# EAGLE design awc_v1 (EAGLE 8.4.2)
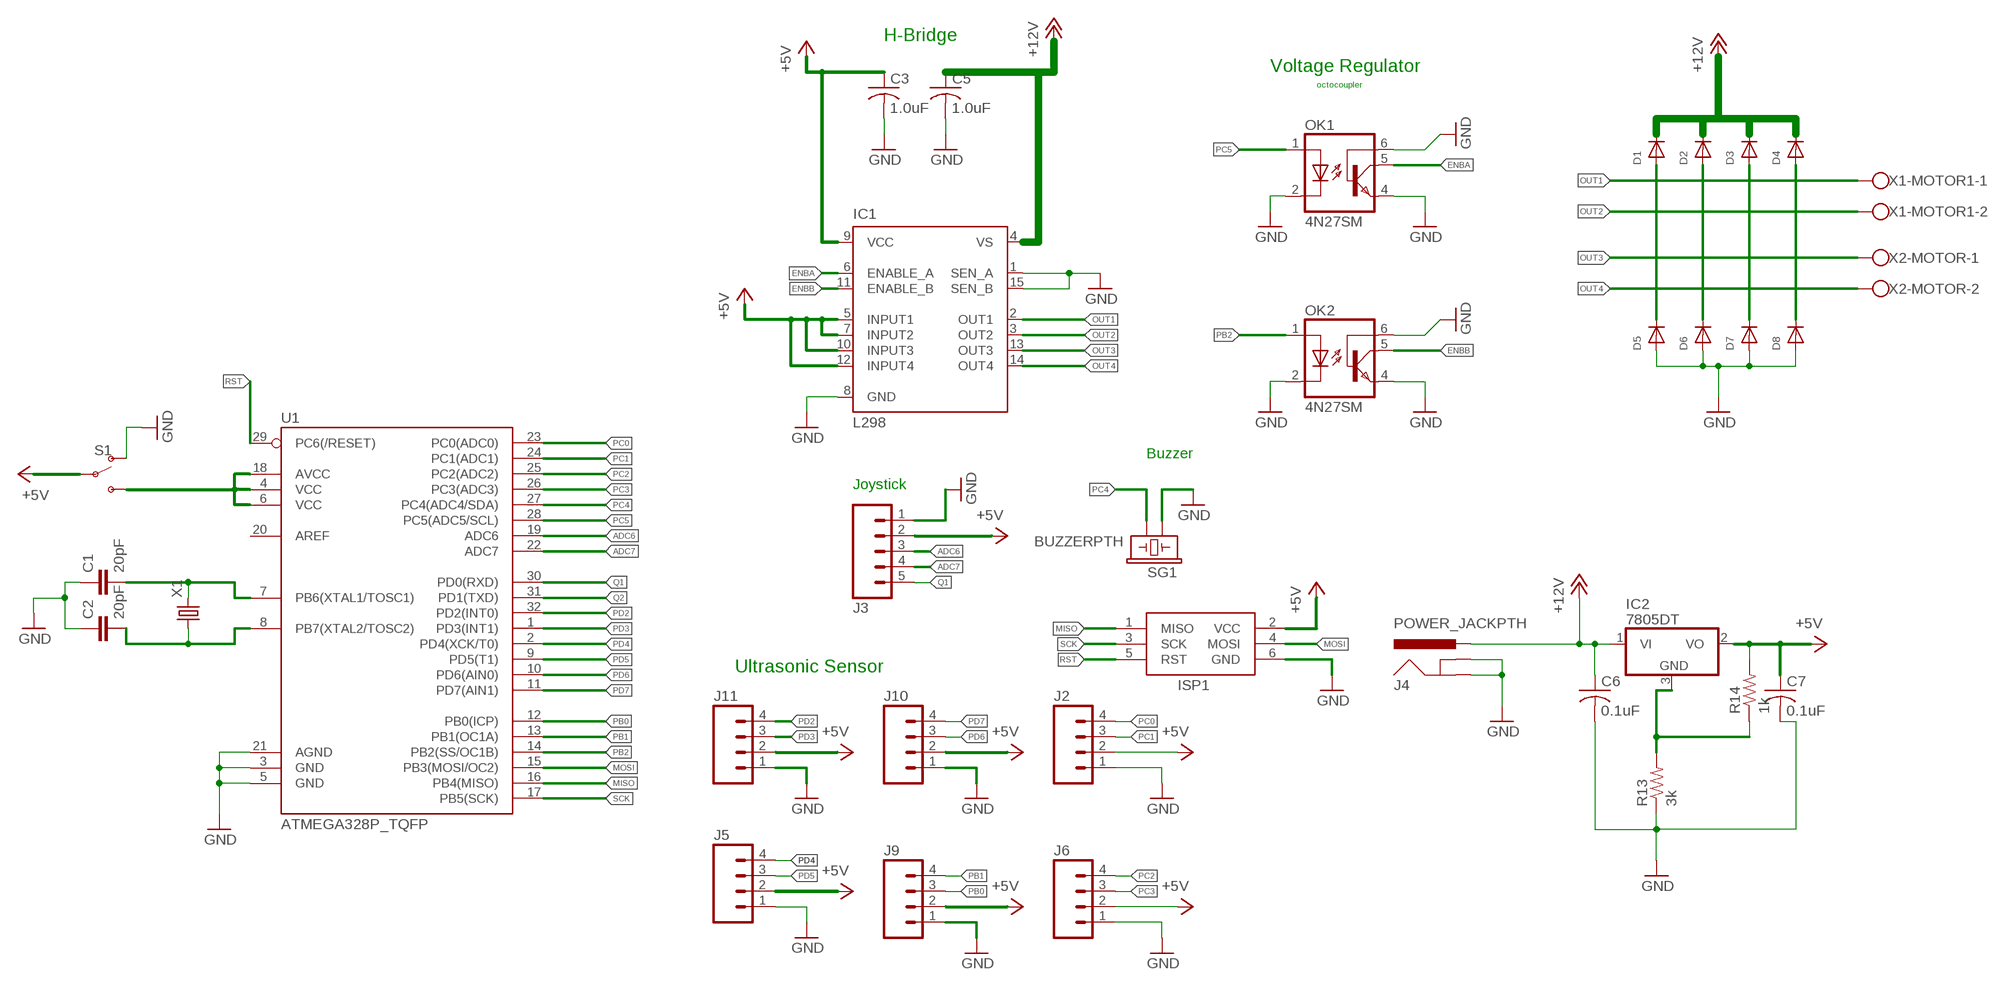
[diagram p0: schematic, sheet 1]

## Parts
C1  20pF  C-EUC0805  [C0805]
C2  20pF  C-EUC0805  [C0805]
C3  1.0uF  C-USC0805  [C0805]
C5  1.0uF  C-USC0805  [C0805]
C6  0.1uF  C-USC0805  [C0805]
C7  0.1uF  C-USC0805  [C0805]
D1  DIODESOD-523  [SOD-523]
D2  DIODESOD-523  [SOD-523]
D3  DIODESOD-523  [SOD-523]
D4  DIODESOD-523  [SOD-523]
D5  DIODESOD-523  [SOD-523]
D6  DIODESOD-523  [SOD-523]
D7  DIODESOD-523  [SOD-523]
D8  DIODESOD-523  [SOD-523]
IC1  L298  [MULTIWATT-15]
IC2  7805DT  [TO252]
ISP1  AVRISP-6  [AVRISP]
J2  M04SCREW_LOCK  [SCREWTERMINAL-3.5MM-4_LOCK]
J3  M05SCREW  [SCREWTERMINAL-3.5MM-5]
J4  POWER_JACKPTH  [POWER_JACK_PTH]
J5  M04SCREW_LOCK  [SCREWTERMINAL-3.5MM-4_LOCK]
J6  M04SCREW_LOCK  [SCREWTERMINAL-3.5MM-4_LOCK]
J9  M04SCREW_LOCK  [SCREWTERMINAL-3.5MM-4_LOCK]
J10  M04SCREW_LOCK  [SCREWTERMINAL-3.5MM-4_LOCK]
J11  M04SCREW_LOCK  [SCREWTERMINAL-3.5MM-4_LOCK]
OK1  4N27SM  [DIL6-SMD]
OK2  4N27SM  [DIL6-SMD]
R13  3k  RESISTOR0402  [0402-RES]
R14  1k  R-US_M0805  [M0805]
S1  SWITCH-SPDT-PTH-11.6X4.0MM  [SWITCH_SPDT_PTH_11.6X4.0MM]
SG1  BUZZERPTH  [BUZZER-12MM]
U1  ATMEGA328P_TQFP  [TQFP32-08]
X1  CRYSTALHC49UP  [HC49UP]
X1-MOTOR1  W237-102  [W237-102]
X2-MOTOR  W237-102  [W237-102]

## Nets
+5V: C3.1 C7.1 IC1.5(INPUT1) IC1.7(INPUT2) IC1.9(VCC) IC1.10(INPUT3) IC1.12(INPUT4) IC2.2(VO) ISP1.2(VCC) J2.2 J3.2 J5.2 J6.2 J9.2 J10.2 J11.2 R14.2 S1.2(P)
+12V: C5.1 C6.1 D1.K(C) D2.K(C) D3.K(C) D4.K(C) IC1.4(VS) IC2.1(VI) J4.PWR
ADC6: J3.3 U1.19(ADC6)
ADC7: J3.4 U1.22(ADC7)
ENBA: IC1.6(ENABLE_A) OK1.5(COL)
ENBB: IC1.11(ENABLE_B) OK2.5(COL)
GND: C1.1 C2.1 C3.2 C5.2 C6.2 C7.2 D5.A D6.A D7.A D8.A IC1.1(SEN_A) IC1.8(GND) IC1.15(SEN_B) ISP1.6(GND) J2.1 J3.1 J4.GND J4.GNDBREAK J5.1 J6.1 J9.1 J10.1 J11.1 OK1.2(C) OK1.4(EMI) OK1.6(BAS) OK2.2(C) OK2.4(EMI) OK2.6(BAS) R13.1 S1.1(O) SG1.+ U1.3(GND) U1.5(GND) U1.21(AGND)
MISO: ISP1.1(MISO) U1.16(PB4(MISO))
MOSI: ISP1.4(MOSI) U1.15(PB3(MOSI/OC2))
N$1: D1.A D5.K(C)
N$2: D2.A D6.K(C)
N$3: D3.A D7.K(C)
N$4: D4.A D8.K(C)
N$5: C1.2 U1.7(PB6(XTAL1/TOSC1)) X1.2
N$6: C2.2 U1.8(PB7(XTAL2/TOSC2)) X1.1
N$7: IC2.3(GND) R13.2 R14.1
N$8: S1.3(S) U1.4(VCC) U1.6(VCC) U1.18(AVCC)
OUT1: IC1.2(OUT1) X1-MOTOR1.1
OUT2: IC1.3(OUT2) X1-MOTOR1.2
OUT3: IC1.13(OUT3) X2-MOTOR.1
OUT4: IC1.14(OUT4) X2-MOTOR.2
PB0: J9.3 U1.12(PB0(ICP))
PB1: J9.4 U1.13(PB1(OC1A))
PB2: OK2.1(A) U1.14(PB2(SS/OC1B))
PC0: J2.4 U1.23(PC0(ADC0))
PC1: J2.3 U1.24(PC1(ADC1))
PC2: J6.4 U1.25(PC2(ADC2))
PC3: J6.3 U1.26(PC3(ADC3))
PC4: SG1.- U1.27(PC4(ADC4/SDA))
PC5: OK1.1(A) U1.28(PC5(ADC5/SCL))
PD2: J11.4 U1.32(PD2(INT0))
PD3: J11.3 U1.1(PD3(INT1))
PD4: J5.4 U1.2(PD4(XCK/T0))
PD5: J5.3 U1.9(PD5(T1))
PD6: J10.3 U1.10(PD6(AIN0))
PD7: J10.4 U1.11(PD7(AIN1))
Q1: J3.5 U1.30(PD0(RXD))
Q2: U1.31(PD1(TXD))
RST: ISP1.5(RST) U1.29(PC6(/RESET))
SCK: ISP1.3(SCK) U1.17(PB5(SCK))
Unconnected: U1.20(AREF)

## Notes on the sheet
- H-Bridge
- Voltage Regulator
- octocoupler
- Buzzer
- Joystick
- Ultrasonic Sensor

## Library data of the parts
C1 C2 = resistor:C-EU: CAPACITOR, European symbol
C3 C5-C7 = adafruit:C-US: CAPACITOR, American symbol
D1-D8 = adafruit:DIODE: Diode SMADIODE - SMA Surface Mount Package 20V 1A Schottky Diode Digikey: 641-1014-6-ND DO-1N4148 - Through Hole Small Current Diode SOD-123 20V 1 A (.5mV Vf) Schottky Diode - Digikey: MBRX120TPMSCT-ND SOD-323 10V 570mA (.38mV Vf, 3ns) Schottky Diode - Digikey: ZLLS410CT-ND SOD-523 30V 30mA Schottky Diode (RB751S-40TE61) - Digikey: RB751S-40TE61CT-ND SOT23-R/W - SOT23 Package (R = Solder Paste/Reflow Ovens, W = Hand-Soldering) BAT54Film 40V 300mA - Digikey: 497-7162-1-ND
IC1 = st-microelectronics:L298: DUAL FULL-BRIDGE DRIVER; MPN: L298N; OC_FARNELL: 1589425; OC_NEWARK: 32M1527
IC2 = ece388:78*: Positive VOLTAGE REGULATOR Added bigger pads to the TO-92 package
ISP1 = adafruit:AVRISP: AVR ISP HEADER Standard 6 pin header for AVR programming
J2 J5 J6 J9-J11 = SparkFun-Connectors:M04: Header 4 Standard 4-pin 0.1" header. Use with straight break away headers (SKU : PRT-00116), right angle break away headers (PRT-00553), swiss pins (PRT-00743), machine pins (PRT-00117), and female headers (PRT-00115). Molex polarized connector foot print use with SKU : PRT-08231 with associated crimp pins and housings. 1MM SMD Version SKU: PRT-10208
J3 = SparkFun-Connectors:M05: Header 5 Standard 5-pin 0.1" header. Use with straight break away headers (SKU : PRT-00116), right angle break away headers (PRT-00553), swiss pins (PRT-00743), machine pins (PRT-00117), and female headers (PRT-00115). Molex polarized connector foot print use with SKU : PRT-08230 with associated crimp pins and housings.; PROD_ID: Combine 8288+8399
J4 = SparkFun-Connectors:POWER_JACK: Power Jack This is the standard 5.5mm barrel jack for power. The PTH is the most common, proven, reliable, footprint. The Slot footprint only works if the mill layer is transmitted to the PCB fab house so be warned. Mating wall wart : TOL-00298 (and others); PROD_ID: CONN-08197
OK1 OK2 = optocoupler:4N*?M: General Purpose 6-Pin Phototransistor Optocouplers Source: http://www.fairchildsemi.com/ds/4N/4N35-M.pdf; MF: FAIRCHILD SEMICONDUCTOR; MPN: 4N27S-M; OC_FARNELL: unknown; OC_NEWARK: 05C3300
R13 = SparkFun-Resistors:RESISTOR: Resistor Basic schematic elements and footprints for 0603, 1206, and PTH resistors.
R14 = adafruit:R-US_: RESISTOR, American symbol
S1 = SparkFun-Switches:SWITCH-SPDT: Single Pole, Double Throw (SPDT) Switch Single-pole, double-throw (SPDT) switch. Variant Overview SMD-AYZ0202 Surface Mount DPDT Switch <https://www.sparkfun.com/products/597> (COM-00597) Used on e.g. LilyPad Arduino USB - ATmega32U4 Board <https://www.sparkfun.com/products/12049> PTH-11.6X4.0MM SPDT Mini Power Switch <https://www.sparkfun.com/products/102> (COM-00102) Used on e.g. SparkFun Simon Says - Through-Hole Soldering Kit <https://www.sparkfun.com/products/10547> (KIT-10547) PTH-11.6X4.0MM-KIT KIT version of SPDT Mini Power Switch - Simplifies soldering by removing tStop of switch pins - only one side can be soldered. PTH-11.6X4.0MM-LOCK LOCK version of SPDT Mini Power Switch - Offset pins hold switch in place for easier soldering. SMD-RIGHT-ANGLE Surface Mount Right Angle Switch <https://www.sparkfun.com/products/10860> (COM-10860) Used on e.g. SparkFun ESP8266 Thing <https://www.sparkfun.com/products/13231>; PROD_ID: SWCH-08261; SF_SKU: COM-00102
SG1 = SparkFun-Electromechanical:BUZZER: Buzzer 12mm Spark Fun Electronics SKU : Comp-Buzzer
U1 = SparkFun-DigitalIC:ATMEGA328P_TQFP; PROD_ID: IC-09069
X1 = adafruit:CRYSTAL: CRYSTAL; OC_FARNELL: unknown; OC_NEWARK: unknown
X1-MOTOR1 X2-MOTOR = con-wago-500:W237-102: WAGO SCREW CLAMP; MPN: 237-102; OC_FARNELL: unknown; OC_NEWARK: 70K9898

## Board
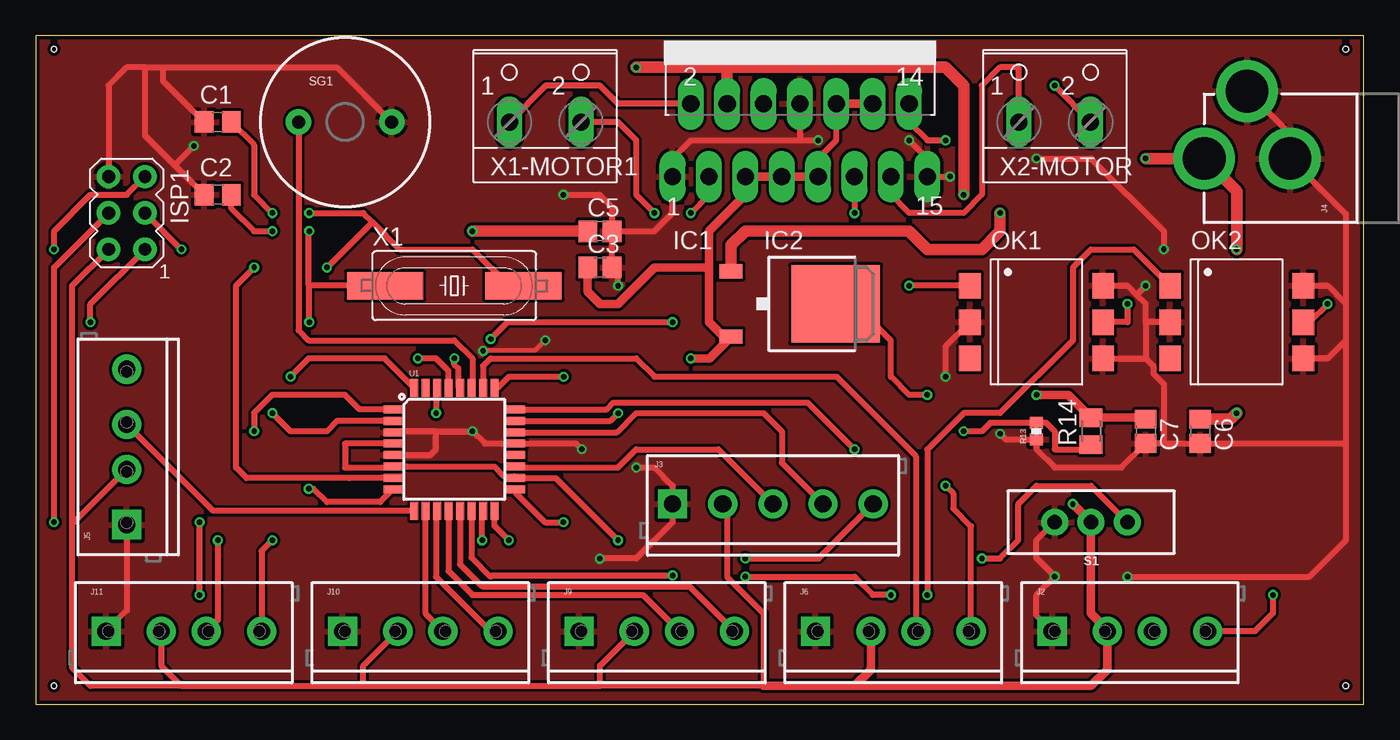
[diagram p1: board, top side]
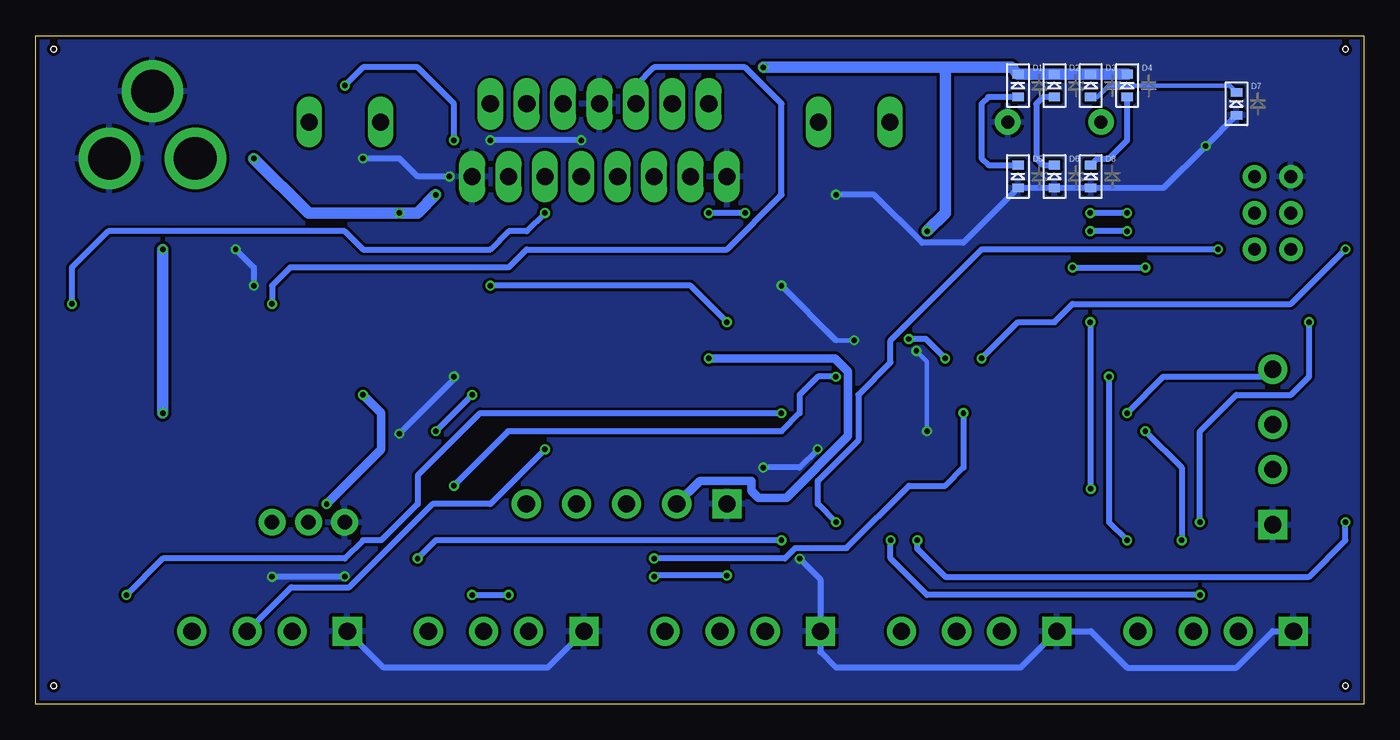
[diagram p2: board, bottom side, seen from below]

Size 92.69 x 46.66 mm. Coordinates in mm from the lower left corner, seen from the top.
Outline: 0,0 92.69,0 92.69,46.66 0,46.66 0,0
Copper layers (1*16): Top 0.035mm / dielectric 1.5mm / Bottom 0.035mm
Design rules "Dirty8TS": minimum track width 8mil, minimum drill 15mil, track to track 8mil, track to pad 8mil, pad to pad 8mil, via to via 8mil, smd to smd 0mil, copper to edge 10mil, drill to drill 10mil, minimum pad ring 10mil, minimum via ring 6mil, stop-mask expansion 2mil, vias tented up to drill 25mil, thermal gap 10mil
Holes 0.38 mm at 1.27,45.72 1.27,1.27 91.44,1.27 91.44,45.72

### Footprints (pad centres in the part's own frame; a part is rotated, then mirrored left to right if it is on the bottom)
C0805 = smd 1.3 x 1.5: 1 -0.95,0; 2 0.95,0
C0805' = smd 1.3 x 1.5: 1 -0.85,0; 2 0.85,0
SOD-523 = smd 0.8 x 0.6: A 0,-0.8; K 0,0.8
MULTIWATT-15 = drill 1.2 long: 1 -8.89,-7.62; 2 -7.62,-2.54; 3 -6.35,-7.62; 4 -5.08,-2.54; 5 -3.81,-7.62; 6 -2.54,-2.54; 7 -1.27,-7.62; 8 0,-2.54; 9 1.27,-7.62; 10 2.54,-2.54; 11 3.81,-7.62; 12 5.08,-2.54; 13 6.35,-7.62; 14 7.62,-2.54; 15 8.89,-7.62
TO252 = smd 1 x 1.6: 1 -2.28,-4.8; 2 2.28,-4.8 | smd 5.4 x 6.2: 3 0,2.5
AVRISP = drill 0.9 pad 1.626: 1 -1.27,2.54; 2 1.27,2.54; 3 -1.27,0; 4 1.27,0; 5 -1.27,-2.54; 6 1.27,-2.54
SCREWTERMINAL-3.5MM-4_LOCK = drill 1.2 pad 2.032 square: 1 -0.178,0 | drill 1.2 pad 2.032: 2 3.678,0; 3 6.822,0; 4 10.678,0
SCREWTERMINAL-3.5MM-5 = drill 1.2 pad 2.032 square: 1 0,0 | drill 1.2 pad 2.032: 2 3.5,0; 3 7,0; 4 10.5,0; 5 14,0
POWER_JACK_PTH = drill 2.997 pad 4.318: GND 0,7.7; GNDBREAK 4.7,10.7; PWR 0,13.7
DIL6-SMD = smd 1.78 x 1.52: 1 -2.54,-4.645; 2 0,-4.645; 3 2.54,-4.645; 4 2.54,4.645; 5 0,4.645; 6 -2.54,4.645
0402-RES = smd 0.85 x 0.9: 1 -0.58,0; 2 0.58,0
M0805 = smd 1.3 x 1.6: 1 -0.95,0; 2 0.95,0
SWITCH_SPDT_PTH_11.6X4.0MM = drill 1.016 pad 1.88: 1 0,2.54; 2 0,0; 3 0,-2.54
BUZZER-12MM = drill 0.9 pad 1.778: + 3.25,0; - -3.25,0
TQFP32-08 = smd 1.27 x 0.559: 1 -4.293,2.8; 2 -4.293,2; 3 -4.293,1.2; 4 -4.293,0.4; 5 -4.293,-0.4; 6 -4.293,-1.2; 7 -4.293,-2; 8 -4.293,-2.8; 17 4.293,-2.8; 18 4.293,-2; 19 4.293,-1.2; 20 4.293,-0.4; 21 4.293,0.4; 22 4.293,1.2; 23 4.293,2; 24 4.293,2.8 | smd 0.559 x 1.27: 9 -2.8,-4.293; 10 -2,-4.293; 11 -1.2,-4.293; 12 -0.4,-4.293; 13 0.4,-4.293; 14 1.2,-4.293; 15 2,-4.293; 16 2.8,-4.293; 25 2.8,4.293; 26 2,4.293; 27 1.2,4.293; 28 0.4,4.293; 29 -0.4,4.293; 30 -1.2,4.293; 31 -2,4.293; 32 -2.8,4.293
HC49UP = smd 5.334 x 1.93: 1 -4.826,0; 2 4.826,0
W237-102 = drill 1.194 long: 1 -2.5,-1.27; 2 2.5,-1.27

### Placement (x,y rotation side)
C1  12.7,40.64 0 top
C2  12.7,35.56 0 top
C3  1.0uF  [C0805']  39.37,30.48 0 top
C5  1.0uF  [C0805']  39.37,33.02 0 top
C6  0.1uF  [C0805']  81.28,19.05 270 top
C7  0.1uF  [C0805']  77.47,19.05 270 top
D1  24.13,43.18 0 bottom
D2  21.59,43.18 0 bottom
D3  19.05,43.18 0 bottom
D4  16.51,43.18 0 bottom
D5  24.13,36.83 0 bottom
D6  21.59,36.83 0 bottom
D7  8.89,41.91 0 bottom
D8  19.05,36.83 0 bottom
IC1  53.34,44.45 0 top
IC2  53.34,27.94 270 top
ISP1  6.35,34.29 180 top
J2  71.12,5.08 0 top
J3  44.45,13.97 0 top
J4  95.25,38.1 90 top
J5  6.35,12.7 90 top
J6  54.61,5.08 0 top
J9  38.1,5.08 0 top
J10  21.59,5.08 0 top
J11  5.08,5.08 0 top
OK1  69.85,26.67 270 top
OK2  83.82,26.67 270 top
R13  69.85,19.05 90 top
R14  73.66,19.05 90 top
S1  73.66,12.7 90 top
SG1  21.59,40.64 0 top
U1  29.21,17.78 0 top
X1  29.21,29.21 0 top
X1-MOTOR1  35.56,41.91 0 top
X2-MOTOR  71.12,41.91 0 top

### Tracks (layer width: path | path; a pad name or v marks a point on that pad's centre or on a via)
+5V  (via drill 0.38)
  Top 0.406: J11.2 8.76,2.67 10.16,1.27 | 10.16,1.27 22.86,1.27 | 22.86,1.27 39.37,1.27 | 39.37,1.27 39.37,2.67 J9.2 | 39.37,1.27 50.8,1.27 50.8,6.35 48.26,8.89 48.26,13.66 J3.2 | 10.16,1.27 3.81,1.27 2.54,2.54 2.54,12.57 | J5.2 2.54,12.57 | 2.54,12.57 2.54,29.21 ISP1.2 | IC2.2 | IC1.9 54.61,38.1 55.88,39.37 IC1.10 | J10.2 22.86,2.67 22.86,1.27
  Top 0.61: IC1.9 IC1.7 IC1.5 49.53,35.56 46.99,33.02 46.99,30.48 | IC1.10 IC1.12 | C7.1 77.37,20 R14.2 72.23,21.43 | C3.1 38.52,28.79 39.37,27.94 40.64,27.94 43.18,30.48 46.99,30.48 | 72.23,21.43 72.07,21.59 | J6.2 58.29,2.41 57.15,1.27 | 57.15,1.27 50.8,1.27 | 57.15,1.27 73.66,1.27 74.8,2.41 J2.2 74.8,5.21 73.66,6.35 S1.2 v72.39,13.97 | v45.72,24.13 47.01,24.13 48.27,25.39 | 48.27,25.39 IC2.2 | 46.99,30.48 46.99,26.67 48.27,25.39 | 72.23,21.43 72.07,21.59 | 72.07,21.59 v69.85,21.59
  Bottom 0.61: J3.2 46.33,15.59 42.74,15.59 42.74,14.89 42.26,14.4 40.29,14.4 35.99,18.7 35.99,23.21 36.92,24.13 v45.72,24.13 | v72.39,13.97 68.58,17.78 68.58,18.24 68.58,18.89 68.58,20.32 v69.85,21.59
+12V  (via drill 0.38)
  Top 0.813: 48.26,44.45 63.5,44.45 64.77,43.18 v64.77,35.56 | IC1.4 48.26,44.45 | IC2.1 48.54,32.03 49.53,33.02 60.96,33.02 62.23,31.75 66.04,31.75 67.31,33.02 v67.31,34.29 | v83.82,31.75 83.82,35.83 J4.PWR v77.47,38.1 | v83.82,20.32 83.4,19.9 C6.1 | v30.48,33.02 C5.1 | v41.91,44.45 48.26,44.45
  Bottom 0.813: 29.21,44.45 29.21,34.29 v30.48,33.02 | 29.21,44.45 24.6,44.45 D1.K D2.K D3.K D4.K | v83.82,31.75 v83.82,20.32 | 29.21,44.45 v41.91,44.45 | v64.77,35.56 66.04,34.29 v67.31,34.29 73.66,34.29 v77.47,38.1
ADC6
  Top 0.406: U1.19 33.57,16.51 40.64,16.51 41.91,17.78 47.64,17.78 J3.3
ADC7
  Top 0.406: 33.57,19.05 U1.22 40.57,18.98 41.91,20.32 50.8,20.32 52.07,19.05 52.07,16.85 J3.4
ENBA  (via drill 0.38)
  Top 0.406: v76.2,27.94 76.2,26.67 OK1.5
  Bottom 0.406: IC1.6 50.8,43.18 49.53,44.45 43.18,44.45 40.64,41.91 40.64,35.56 44.45,31.75 58.42,31.75 59.69,30.48 74.93,30.48 76.2,29.21 v76.2,27.94
ENBB  (via drill 0.38)
  Top 0.406: OK2.5 88.9,26.67 v90.17,27.94 | IC1.11 v57.15,34.29
  Bottom 0.406: v90.17,27.94 90.17,30.48 87.63,33.02 71.12,33.02 69.85,31.75 60.96,31.75 59.69,33.02 58.42,33.02 v57.15,34.29
GND  (via drill 0.38)
  Top 0.305: v31.22,24.66 31.49,24.66 31.52,24.69 34.85,24.69 v35.56,25.4
  Top 0.406: OK2.6 90.17,29.21 91.44,27.94 | 91.44,27.94 91.44,25.4 | 91.44,25.4 90.17,24.13 OK2.4 | 91.44,25.4 91.44,18.2 | S1.1 69.85,11.43 69.85,10.16 69.87,10.16 v71.13,8.9 71.13,8.9 69.85,7.62 69.85,6.17 J2.1 | J5.1 6.35,6.53 J11.1 | SG1.+ 21.03,44.45 8.89,44.45 | ISP1.6 5.08,43.18 6.35,44.45 7.62,44.45 | 7.62,44.45 8.89,44.45 | J4.GNDBREAK 87.55,39.8 J4.GND 91.44,34.21 91.44,27.94 | C1.1 8.89,43.5 8.89,44.45 | C2.1 9.69,37.62 | 9.69,37.62 7.62,39.69 7.62,44.45 | 78.74,18.2 C7.2 75.78,16.51 71.12,16.51 69.85,17.78 R13.1 67.72,18.47 v67.31,18.88 | 78.74,18.2 C6.2 91.44,18.2 | C5.2 C3.2 40.64,30.06 v40.64,29.21 | U1.3 24.92,19.05 27.94,19.05 | 27.94,19.05 v30.48,19.05 31.35,18.18 U1.21 37.72,18.18 v38.11,17.79 | U1.5 27.54,17.38 27.94,17.78 27.94,19.05 | C5.2 43.18,33.02 44.45,34.29 IC1.1 44.45,38.1 45.72,39.37 53.34,39.37 | IC1.8 53.34,39.37 | v60.96,39.37 62.23,38.1 IC1.15 v63.82,36.83 | 91.44,18.2 91.44,11.43 88.9,8.89 v76.2,8.89 | OK1.6 76.2,29.21 76.83,28.57 | 76.83,28.57 77.47,27.94 77.47,26.67 | OK1.4 77.47,24.13 | 77.47,26.67 77.47,24.13 | OK2.2 77.47,26.67 | 77.47,24.13 78.01,23.59 78.01,23.07 78.74,22.34 78.74,18.2 | C5.2 40.22,34.71 39.37,35.56 v36.83,35.56 | OK1.2 63.5,24.96 v63.5,22.86 | 9.69,37.62 v11.03,38.97 | v41.91,16.51 43.18,16.51 44.45,15.24 J3.1 44.45,12.7 41.91,10.16 39.38,10.16 v39.36,10.14 | 53.34,39.37 v54.61,39.37 | v78.74,31.75 78.74,33.02 73.66,38.1 v69.85,38.1 | v77.47,29.21 76.83,28.57
  Bottom 0.305: v31.22,24.66 30.48,23.92 v30.48,19.05 | v35.56,25.4 36.83,25.4
  Bottom 0.406: J6.1 56.97,2.54 68.4,2.54 J2.1 | J11.1 6.35,5.08 8.89,2.54 16.51,2.54 19.05,5.08 J10.1 23.95,2.54 36.83,2.54 37.92,3.63 J9.1 37.92,8.71 v39.35,10.14 v39.36,10.14 | v63.5,22.86 63.5,22.69 v67.31,18.88 | D7.A v11.03,38.97 13.97,36.03 D8.A D6.A D5.A 27.95,32.21 30.82,32.21 34.17,35.56 v36.83,35.56 | v38.11,17.79 39.39,16.51 v41.91,16.51 | v78.74,31.75 77.47,30.48 v77.47,29.21 | v76.2,8.89 76.18,8.9 v71.13,8.9 | v69.85,38.1 67.31,38.1 66.04,36.83 v63.82,36.83 | v54.61,39.37 v60.96,39.37 | 36.83,25.4 v40.64,29.21
  pour Top: -1.27,48.26 -1.27,-1.27 93.98,-1.27 93.98,48.26
  pour Bottom: -1.27,48.26 -1.27,-1.27 93.98,-1.27 93.98,48.26
MISO  (via drill 0.38)
  Top 0.406: v3.81,26.67 3.81,27.94 ISP1.1 | v11.43,7.62 v11.43,12.7 | v33.02,11.43 32.01,12.44 U1.16
  Bottom 0.406: v11.43,7.62 30.48,7.62 33.02,10.16 v33.02,11.43 | v11.43,12.7 11.43,19.05 8.89,21.59 5.08,21.59 3.81,22.86 v3.81,26.67
MOSI  (via drill 0.38)
  Top 0.406: ISP1.4 1.27,30.48 v1.27,12.7 | v31.16,11.43 31.16,13.44 U1.15
  Bottom 0.406: v31.16,11.43 31.16,10.84 29.21,8.89 3.81,8.89 1.27,11.43 v1.27,12.7
N$1
  Bottom 0.406: D5.K 26.2,37.63 26.67,38.1 26.67,41.91 26.2,42.38 D1.A
N$2
  Bottom 0.406: D2.A 22.39,42.38 22.86,41.91 22.86,38.1 22.39,37.63 D6.K
N$3
  Bottom 0.305: D3.A 18.58,42.38 17.78,43.18 9.36,43.18 D7.K
N$4
  Bottom 0.406: D8.K 18.58,38.1 17.78,38.1 16.51,39.37 D4.A
N$5  (via drill 0.38)
  Top 0.406: U1.7 21.9,15.78 21.89,15.78 14.7,15.78 13.97,16.51 13.97,29.21 v15.24,30.48 | X1.2 33.02,29.21 30.48,31.75 25.4,31.75 23.5,33.66 | C1.2 15.24,39.05 15.24,35.56 v16.51,34.29 | v19.09,34.29 22.86,34.29 23.5,33.66 | v20.32,30.48 23.5,33.66
  Bottom 0.406: v20.32,30.48 v15.24,30.48 | v16.51,34.29 v19.09,34.29
N$6  (via drill 0.38)
  Top 0.406: C2.2 13.65,34.61 15.24,33.02 v16.51,33.02 | X1.1 19.05,29.21 | 19.09,29.25 19.05,29.21 | 19.05,29.21 19.05,32.98 v19.09,33.02 | U1.8 24.03,14.1 20.32,14.1 19.39,15.03 v19.05,15.03 | 19.05,29.21 19.05,26.71 v19.09,26.67
  Bottom 0.406: v16.51,33.02 v19.09,33.02 | v19.09,26.67 19.09,15.07 v19.05,15.03
N$7  (via drill 0.38)
  Top 0.406: R14.1 73.34,17.78 71.12,17.78 71.12,19.05 70.54,19.63 R13.2 66.62,19.63 66.04,19.05 v64.77,19.05 | IC2.3 57.15,27.94 59.69,25.4 59.69,22.86 60.96,21.59 v62.23,21.59
  Bottom 0.406: v64.77,19.05 v62.23,21.59
N$8  (via drill 0.38)
  Top 0.406: U1.4 21.59,18.18 21.59,16.51 24.99,16.51 U1.6 32.01,16.58 32.7,15.89 33.39,15.89 U1.18 36.29,15.78 v40.64,11.43 | S1.3 73.66,15.24 69.85,15.24 68.58,13.97 68.58,11.43 67.31,10.16 v66.04,10.16
  Bottom 0.406: v40.64,11.43 64.77,11.43 v66.04,10.16
OUT1
  Top 0.406: 35.58,43.16 X1-MOTOR1.1 | 35.58,43.16 35.6,43.18 | IC1.2 40.64,41.91 39.37,43.18 35.6,43.18 | 35.6,43.18 35.58,43.16
OUT2  (via drill 0.38)
  Top 0.406: IC1.3 46.99,35.56 v45.72,34.29 | X1-MOTOR1.2 40.64,40.64 41.91,39.37 41.91,35.56 v43.18,34.29
  Bottom 0.406: v43.18,34.29 v45.72,34.29
OUT3
  Top 0.406: X2-MOTOR.1 68.62,44.41 68.58,44.45 67.31,44.45 66.04,43.18 66.04,35.56 64.77,34.29 60.96,34.29 59.69,35.56 IC1.13
OUT4  (via drill 0.38)
  Top 0.406: IC1.14 60.96,40.64 62.23,39.37 v63.5,39.37 | v71.12,43.18 73.62,40.68 X2-MOTOR.2
  Bottom 0.406: v71.12,43.18 69.85,44.45 66.04,44.45 63.5,41.91 v63.5,39.37
PB0
  Top 0.406: J9.3 42.38,7.62 30.48,7.62 28.81,9.29 U1.12
PB1
  Top 0.406: U1.13 29.61,9.76 31.14,8.23 45.63,8.23 J9.4
PB2  (via drill 0.38)
  Top 0.406: OK2.1 76.64,31.75 73.66,31.75 72.39,30.48 72.39,25.4 67.31,20.32 64.77,20.32 62.23,17.78 v62.23,7.62 | v59.69,7.62 58.42,7.62 57.15,8.89 v49.53,8.89 | U1.14 30.41,10.23 31.75,8.89 31.84,8.98 v44.45,8.98
  Bottom 0.406: v62.23,7.62 v59.69,7.62 | v44.45,8.98 49.44,8.98 v49.53,8.89
PC0  (via drill 0.38)
  Top 0.406: U1.23 40.1,19.78 40.62,20.3 v40.65,20.3 | v86.36,7.62 86.36,6.35 85.09,5.08 J2.4
  Bottom 0.406: v86.36,7.62 83.82,10.16 71.12,10.16 69.85,11.43 68.58,11.43 66.04,13.97 66.04,15.95 61.67,20.32 61.65,20.3 v40.65,20.3
PC1  (via drill 0.38)
  Top 0.406: U1.24 39.86,20.58 40.34,21.05 53.88,21.05 v57.15,17.78
  Bottom 0.406: J2.3 74.87,8.16 70.82,8.16 65,13.97 60.96,13.97 v57.15,17.78
PC2  (via drill 0.38)
  Top 0.406: J6.4 65.29,12.41 64.04,13.67 64.04,14.7 v63.5,15.24 | U1.25 32.23,22.07 33.02,22.86 36.84,22.86 v36.85,22.85
  Bottom 0.406: v63.5,15.24 63.5,15.28 59.73,19.05 40.64,19.05 39.37,20.32 39.37,21.59 38.1,22.86 38.09,22.85 v36.85,22.85
PC3
  Top 0.406: U1.26 31.21,23.59 31.75,24.13 41.91,24.13 43.18,22.86 55.88,22.86 61.43,17.31 J6.3
PC4
  Top 0.406: SG1.- 18.34,26.11 19.05,25.4 29.21,25.4 30.48,24.13 30.48,22.14 U1.27
PC5  (via drill 0.38)
  Top 0.406: OK1.1 v60.96,29.21 | U1.28 29.5,22.19 29.5,23.44 29.21,23.72 v29.21,24.13 | v31.75,25.49 32.93,26.67 v44.45,26.67
  Bottom 0.406: v60.96,29.21 46.99,29.21 v44.45,26.67 | v31.75,25.49 30.57,25.49 v29.21,24.13
PD2  (via drill 0.38)
  Top 0.406: J11.4 15.76,10.68 v16.51,11.43 | U1.32 24.35,24.13 19.05,24.13 v17.78,22.86
  Bottom 0.406: v16.51,11.43 17.78,12.7 v17.78,22.86
PD3  (via drill 0.38)
  Top 0.406: U1.1 22.6,20.58 21.59,21.59 16.51,21.59 15.24,20.32 v15.24,19.05 | J11.3 12.7,5.88 v12.7,11.43
  Bottom 0.406: v15.24,19.05 12.7,16.51 v12.7,11.43
PD4  (via drill 0.38)
  Top 0.406: U1.2 21.05,19.78 20.32,19.05 17.78,19.05 v16.51,20.32
  Bottom 0.406: J5.4 6.87,22.86 13.97,22.86 v16.51,20.32
PD5
  Top 0.406: U1.9 12.38,13.49 J5.3
PD6
  Top 0.406: J10.3 27.21,6.28 U1.10
PD7
  Top 0.406: U1.11 27.94,13.42 27.94,8.89 31.75,5.08 J10.4
Q1  (via drill 0.38)
  Top 0.406: J3.5 54.64,10.16 v49.53,10.16 | 27.94,22 U1.30 27.94,22 | 27.94,22 v27.94,20.32
  Bottom 0.406: v49.53,10.16 40.41,10.16 39.67,10.89 36.1,10.89 31.75,15.24 29.21,15.24 27.94,16.51 v27.94,20.32
RST  (via drill 0.38)
  Top 0.406: U1.29 28.81,23.26 27.94,24.13 v26.67,24.13 | ISP1.5 6.35,35.56 3.81,35.56 1.27,33.02 v1.27,31.75
  Bottom 0.406: v26.67,24.13 24.13,26.67 21.59,26.67 20.32,27.94 5.08,27.94 v1.27,31.75
SCK  (via drill 0.38)
  Top 0.406: U1.17 33.5,14.76 35.56,12.7 v36.83,12.7 | ISP1.3 v10.16,31.75
  Bottom 0.406: v36.83,12.7 38.1,13.97 38.1,15.59 35.28,18.41 35.28,21.59 33.02,23.85 33.02,25.4 26.67,31.75 v10.16,31.75